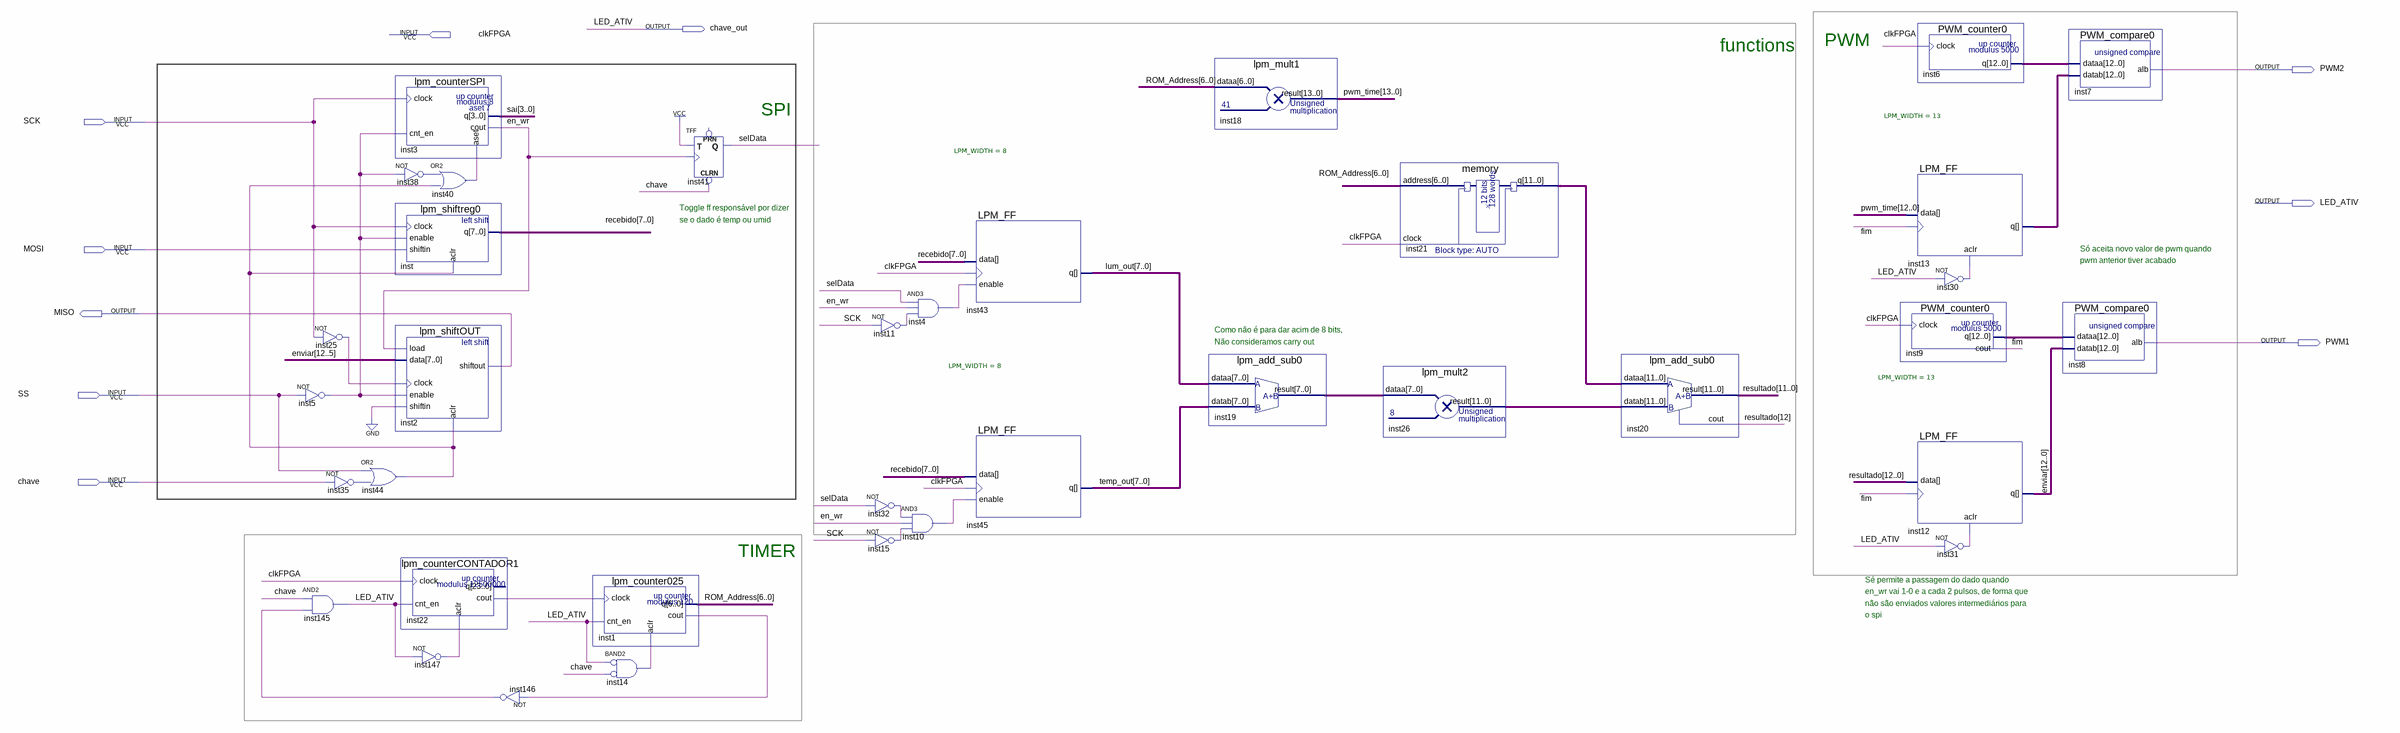
[diagram p0: schematic sheet]
// Quartus schematic projeto3sd.bdf as structural Verilog: 36 symbols, 10 pins
module projeto3sd (
  input  clkFPGA,
  input  SCK,
  input  MOSI,
  input  SS,
  input  chave,
  output chave_out,
  output PWM2,
  output LED_ATIV,
  output MISO,
  output PWM1
);

  wire en_wr, fim, inst1_cout, inst4_out, inst5_out, inst10_out, inst11_out, inst14_out, inst15_out,
       inst22_cout, inst25_out, inst30_out, inst31_out, inst32_out, inst35_out, inst38_out, inst40_out,
       inst44_out, inst146_out, inst147_out, selData;
  wire [3:0] sai;
  wire [6:0] ROM_Address;
  wire [7:0] inst19_result, lum_out, recebido, temp_out;
  wire [11:0] inst21_q, inst26_result;
  wire [12:0] enviar, inst6_q, inst9_q, inst13_q, resultado;
  wire [13:0] pwm_time;

  not inst25 (inst25_out, SCK);
  not inst5 (inst5_out, SS);
  and inst145 (chave_out, chave, inst146_out);
  or inst44 (inst44_out, SS, inst35_out);
  not inst35 (inst35_out, chave);
  lpm_counterSPI inst3 (.clock(SCK), .cnt_en(inst5_out), .aset(inst40_out), .cout(en_wr), .q(sai));
  not inst38 (inst38_out, inst5_out);
  lpm_shiftreg0 inst (.clock(SCK), .enable(inst5_out), .shiftin(MOSI), .aclr(inst44_out), .q(recebido));
  lpm_shiftOUT inst2 (
    .load(en_wr), .data(enviar[12:5]), .clock(inst25_out), .enable(inst5_out), .shiftin(1'b0),
    .aclr(inst44_out), .shiftout(MISO));
  lpm_counterCONTADOR1 inst22 (.clock(clkFPGA), .cnt_en(chave_out), .aclr(inst147_out), .cout(inst22_cout));  // open: q
  not inst147 (inst147_out, chave_out);
  or inst40 (inst40_out, inst38_out, inst44_out);
  not inst146 (inst146_out, inst1_cout);
  lpm_counter025 inst1 (.clock(inst22_cout), .cnt_en(chave_out), .aclr(inst14_out), .cout(inst1_cout), .q(ROM_Address));
  and inst14 (inst14_out, ~chave_out, ~chave);  // BAND2
  TFF inst41 (.CLRN(chave), .T(1'b1), .CLK(en_wr), .Q(selData));  // open: PRN
  not inst11 (inst11_out, SCK);
  not inst32 (inst32_out, selData);
  not inst15 (inst15_out, SCK);
  and inst4 (inst4_out, selData, en_wr, inst11_out);
  and inst10 (inst10_out, inst32_out, en_wr, inst15_out);
  LPM_FF #(.LPM_WIDTH(8)) inst43 (.clock(clkFPGA), .data(recebido), .enable(inst4_out), .q(lum_out));
  LPM_FF #(.LPM_WIDTH(8)) inst45 (.clock(clkFPGA), .data(recebido), .enable(inst10_out), .q(temp_out));
  lpm_mult1 inst18 (.dataa(ROM_Address), .result(pwm_time));
  lpm_add_sub0 inst19 (.dataa(lum_out), .datab(temp_out), .result(inst19_result));
  lpm_mult2 inst26 (.dataa(inst19_result), .result(inst26_result));
  memory inst21 (.address(ROM_Address), .clock(clkFPGA), .q(inst21_q));
  lpm_add_sub0 inst20 (.dataa(inst21_q), .datab(inst26_result), .result(resultado[11:0]), .cout(resultado[12]));
  PWM_counter0 inst9 (.clock(clkFPGA), .cout(fim), .q(inst9_q));
  PWM_counter0 inst6 (.clock(clkFPGA), .q(inst6_q));
  LPM_FF #(.LPM_WIDTH(13)) inst13 (.aclr(inst30_out), .clock(fim), .data(pwm_time[12:0]), .q(inst13_q));
  not inst30 (inst30_out, chave_out);
  LPM_FF #(.LPM_WIDTH(13)) inst12 (.aclr(inst31_out), .clock(fim), .data(resultado), .q(enviar));
  not inst31 (inst31_out, chave_out);
  PWM_compare0 inst7 (.dataa(inst6_q), .datab(inst13_q), .alb(PWM2));
  PWM_compare0 inst8 (.dataa(inst9_q), .datab(enviar), .alb(PWM1));

  assign LED_ATIV = chave_out;

  // Notes on the sheet:
  //   PWM
  //   functions
  //   SPI
  //   Toggle ff responsável por dizer
  //   se o dado é temp ou umid
  //   Só aceita novo valor de pwm quando
  //   pwm anterior tiver acabado
  //   Como não é para dar acim de 8 bits,
  //   Não consideramos carry out
  //   TIMER
  //   Sé permite a passagem do dado quando
  //   en_wr vai 1-0 e a cada 2 pulsos, de forma que 
  //   não são enviados valores intermediários para
  //   o spi
endmodule
